# Altium project LCD20x4_I2C.PrjPcb
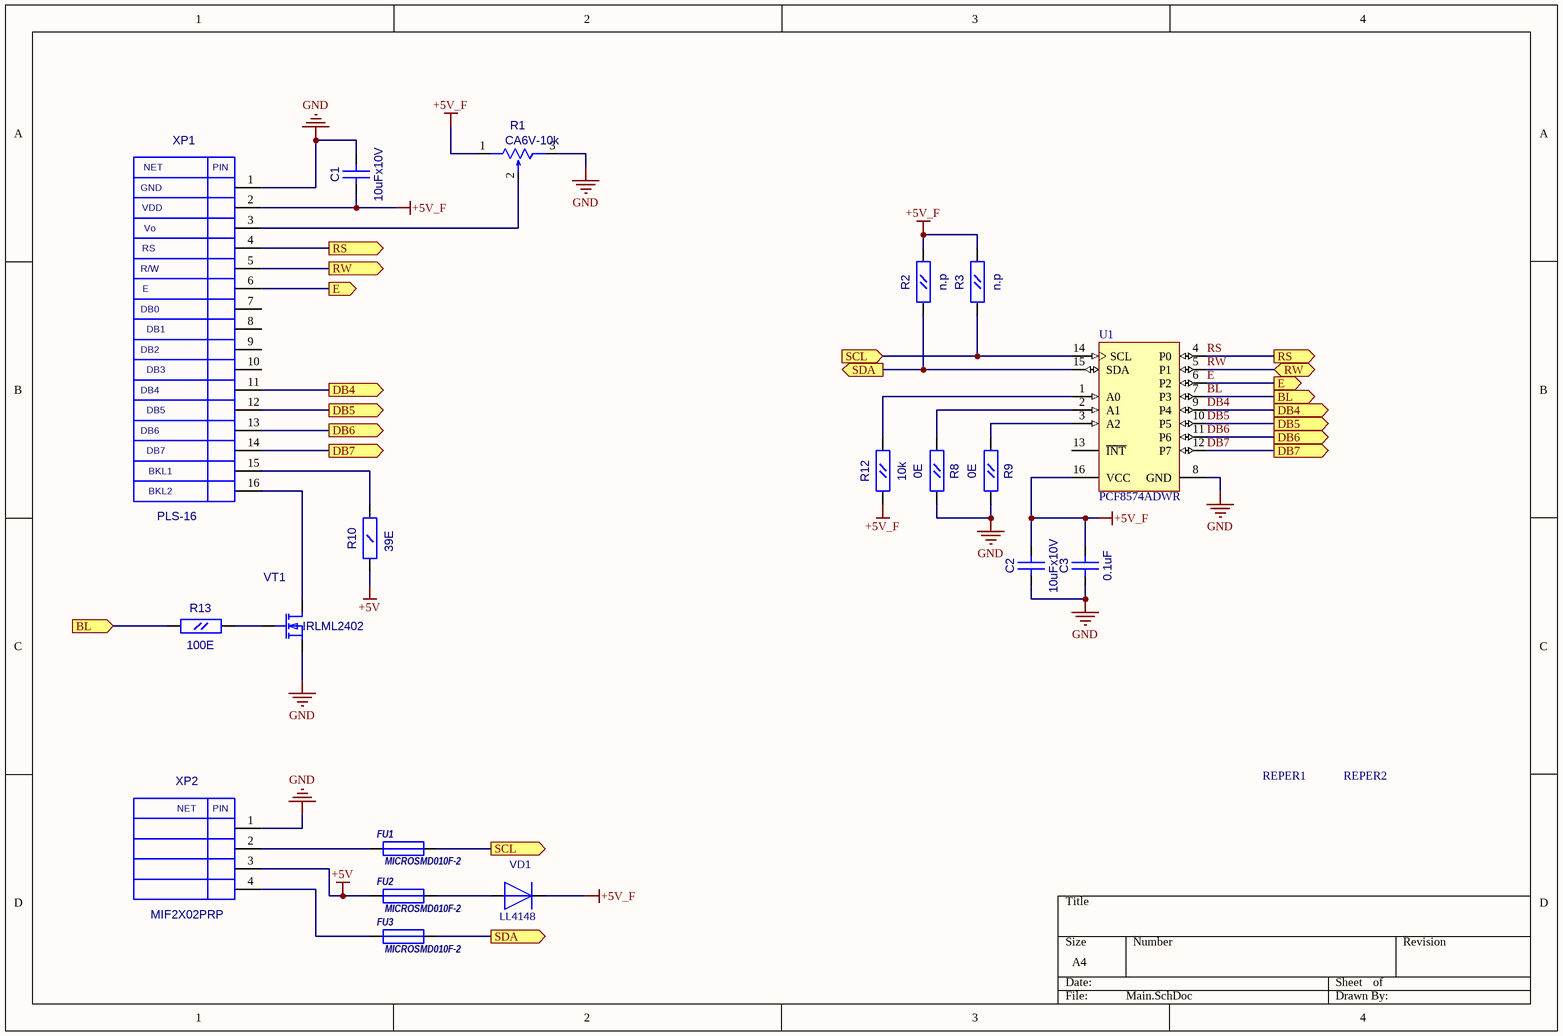
[diagram p0: Main.SchDoc]
1 sheet, 21 parts. Net scope: flat (ports and power ports of the same name join across sheets).
Board file: LCD20x4_I2C.PcbDoc

## Sheet Main.SchDoc
size A4

### Parts
C1  10uFx10V  [CC0805]
C2  10uFx10V  [CC0805]
C3  0.1uF  [CC0603]
FU1  MICROSMD010F-2  [RC1210]
FU2  MICROSMD010F-2  [RC1210]
FU3  MICROSMD010F-2  [RC1210]
R1  CA6V-10k  [3318P-1]
R2  n.p  [RC0603]
R3  n.p  [RC0603]
R8  0E  [RC0603]
R9  0E  [RC0603]
R10  39E  [RC1206]
R12  10k  [RC0603]
R13  100E  [RC0603]
REPER1  REPER1.2  [REPER1.2]  (value not drawn)
REPER2  REPER1.2  [REPER1.2]  (value not drawn)
U1  PCF8574ADWR  [DW16_N]
VD1  LL4148  [SOD-80]
VT1  IRLML2402  [SOT-23(123)]
XP1  PLS-16  [PIN16S]
XP2  MIF2X02PRP  [MIF2X02PRP]

### Ports
BL (in), BL (out), DB4 (out), DB5 (out), DB6 (out), DB7 (out), E (out), RS (out), RW (bidir), RW (out), SCL (in), SCL (out), SDA (out)

### Nets
+5V: FU2.1 R10.1(A) XP2.3
+5V_F: C1.1(A) C2.2(B) C3.2(B) R1.1 R2.2(B) R3.2(B) R12.1(A) U1.16(VCC) VD1.2(+) XP1.2
GND: C1.2(B) C2.1(A) C3.1(A) R1.3 R8.2(B) R9.2(B) U1.8(GND) VT1.2(S) XP1.1 XP2.1
BL: R13.1(A) U1.7(P3) ; port BL
DB4: U1.9(P4) XP1.11 ; port DB4
DB5: U1.10(P5) XP1.12 ; port DB5
DB6: U1.11(P6) XP1.13 ; port DB6
DB7: U1.12(P7) XP1.14 ; port DB7
E: U1.6(P2) XP1.6 ; port E
RS: U1.4(P0) XP1.4 ; port RS
RW: U1.5(P1) XP1.5 ; port RW
NetFU1_1: FU1.1 XP2.2
NetFU1_2: FU1.2 R3.1(A) U1.14(SCL) ; port SCL
NetFU2_2: FU2.2 VD1.1(-)
NetFU3_1: FU3.1 XP2.4
NetFU3_2: FU3.2 R2.1(A) U1.15(SDA) ; port SDA
NetR1_2: R1.2 XP1.3
NetR8_1: R8.1(A) U1.2(A1)
NetR9_1: R9.1(A) U1.3(A2)
NetR10_2: R10.2(B) XP1.15
NetR12_2: R12.2(B) U1.1(A0)
NetR13_2: R13.2(B) VT1.1(G)
NetVT1_3: VT1.3(D) XP1.16

Not connected (* = marked no-connect by the designer): REPER1 1; REPER2 1; U1 13(~{INT}); XP1 7 8 9 10

### Notes on the sheet
- (in symbol PLS-16) NET; PIN; GND; VDD; Vo; RS; R/W; E; DB0; DB1; DB2; DB3; DB4; DB5; DB6; DB7; BKL1; BKL2

### Library data of the parts
C1 C2 = CC0805: Value: 10uFx10V
C3 = CC0603: Value: 0.1uF
FU1-FU3 = MICROSMD: Value: MICROSMD010F-2
R1 = 3318P-1: EVND8AA03B25; Value: CA6V-10k
R2 R3 R8 R9 R12 R13 = RC0603
  R2 R3: Value: n.p
  R8 R9: Value: 0E
  R12: Value: 10k
  R13: Value: 100E
R10 = RC1206: Value: 39E
U1 = PCF8574ADWR: Remote 8-Bit I/O Expander for I2C-Bus, 2.5 to 6.0 V, -40 to 85 degC, 16-pin SOIC (DW), Green (RoHS & no Sb/Br); Manufacturer: Texas Instruments; SubFamily: I2C IO Expander; Voltage Nodes(V): 5, 3.3; Interrupt Output: Yes; fSCLK(Max)(MHz): 0.1; VCC(Min)(V): 2.5; VCC(Max)(V): 6; Max Frequency(kHz): 100; I2C Address: 0111 xxx; # of I/Os: 8; DatasheetVersion: SCPS069D; PackageVersion: revG, Jan-2011; PackageReference: DW16; PackageDescription: 16-Pin Small Outline Integrated Circuit, 10.3 x 7.5 mm, Pitch 1.27 mm Pitch; Supplier 1: Digi-Key; Supplier Part Number 1: 296-13105-2-ND; Supplier 2: Digi-Key; Supplier Part Number 2: 296-13105-1-ND; Supplier 3: Digi-Key; Supplier Part Number 3: 296-13105-6-ND; Supplier 4: Newark; Supplier Part Number 4: 75C5233; Supplier 5: Mouser; Supplier Part Number 5: 595-PCF8574ADWR; Eco-Plan: Green (RoHS & no Sb/Br); Reset Input: No; Vcc range(V): 2.5 to 6.0; Push-Pull I/O Type: Yes; Mounting Technology: Surface Mount; PartNumber: PCF8574ADWR; Code_JEDEC: MS-013-AA; ComponentLink1Description: Datasheet; ComponentLink1URL: http://www.ti.com/general/docs/lit/getliterature.tsp?genericPartNumber=PCF8574A&fileType=pdf; ComponentLink2Description: Package Specification; ComponentLink2URL: http://www.ti.com/litv/pdf/msoi003g
VT1 = IRLML2402: N-Channel Enhancement Mode Vertical DMOS FET; OriginalName: 2N7002; Value: *
REPER1 REPER2 = REPER1.2: Value: *
VD1 = LL4148: Value: *
XP1 = PLS-16: Value: *
XP2 = MIF2X02PRP: Value: *